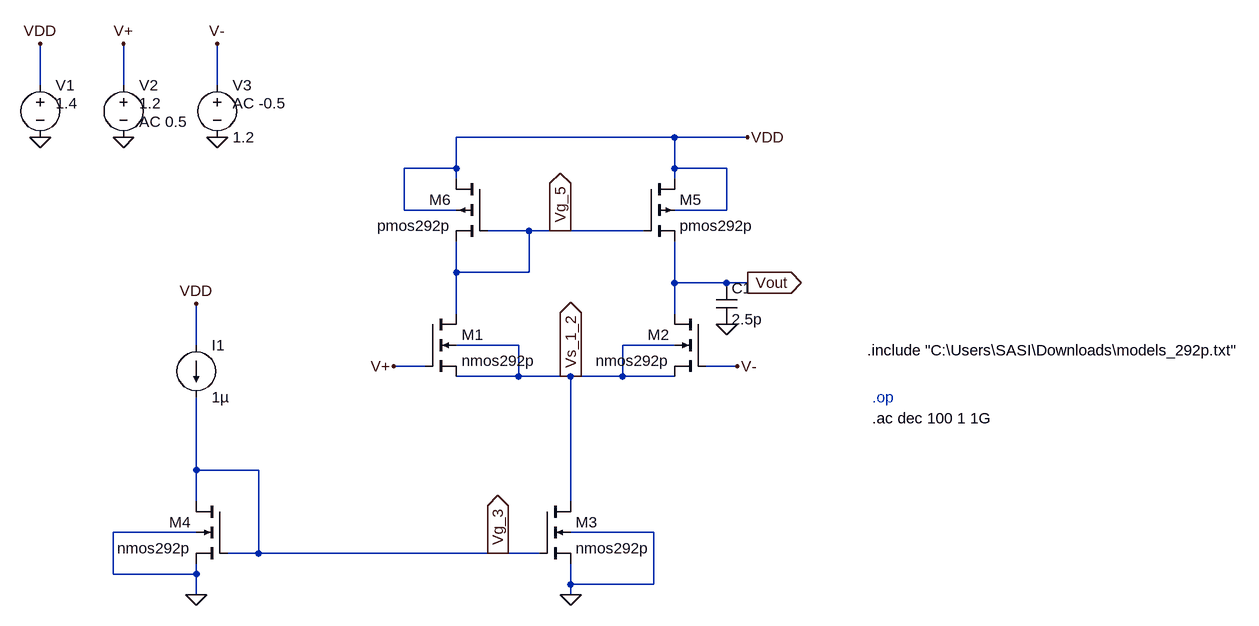
[diagram p0: schematic 5T_OTA_NMOS.asc]
5T_OTA_NMOS.asc, the LTspice schematic file:
Version 4.1
SHEET 1 1052 760
WIRE -864 -64 -864 -128
WIRE -736 -64 -736 -128
WIRE -592 -64 -592 -128
WIRE 112 16 -224 16
WIRE 224 16 112 16
WIRE -224 64 -224 16
WIRE -224 64 -304 64
WIRE 112 64 112 16
WIRE 192 64 112 64
WIRE -224 80 -224 64
WIRE 112 80 112 64
WIRE -304 128 -304 64
WIRE -224 128 -304 128
WIRE 192 128 192 64
WIRE 192 128 112 128
WIRE -112 160 -176 160
WIRE -64 160 -112 160
WIRE 64 160 -64 160
WIRE -224 224 -224 176
WIRE -112 224 -112 160
WIRE -112 224 -224 224
WIRE 112 240 112 176
WIRE 192 240 112 240
WIRE 224 240 192 240
WIRE -224 288 -224 224
WIRE 112 288 112 240
WIRE -624 336 -624 272
WIRE -128 336 -224 336
WIRE 112 336 32 336
WIRE -272 368 -320 368
WIRE 208 368 160 368
WIRE -128 384 -128 336
WIRE -128 384 -224 384
WIRE -48 384 -128 384
WIRE 32 384 32 336
WIRE 32 384 -48 384
WIRE 112 384 32 384
WIRE -624 528 -624 416
WIRE -528 528 -624 528
WIRE -624 576 -624 528
WIRE -48 576 -48 384
WIRE -624 624 -752 624
WIRE 80 624 -48 624
WIRE -528 656 -528 528
WIRE -528 656 -576 656
WIRE -160 656 -528 656
WIRE -96 656 -160 656
WIRE -752 688 -752 624
WIRE -624 688 -624 672
WIRE -624 688 -752 688
WIRE -48 704 -48 672
WIRE 80 704 80 624
WIRE 80 704 -48 704
WIRE -624 720 -624 688
WIRE -48 720 -48 704
FLAG -48 720 0
FLAG -624 720 0
FLAG -864 16 0
FLAG -736 16 0
FLAG -592 16 0
FLAG -736 -128 V+
FLAG -592 -128 V-
FLAG -864 -128 VDD
FLAG -320 368 V+
FLAG 208 368 V-
FLAG 224 16 VDD
FLAG 224 240 Vout
IOPIN 224 240 Out
FLAG -48 384 Vs_1_2
IOPIN -48 384 Out
FLAG -160 656 Vg_3
IOPIN -160 656 Out
FLAG -64 160 Vg_5
IOPIN -64 160 Out
FLAG -624 272 VDD
FLAG 192 304 0
SYMBOL nmos4 -272 288 R0
SYMATTR InstName M1
SYMATTR Value nmos292p
SYMATTR Value2 l=1.260u w=1.92u
SYMBOL nmos4 160 288 M0
SYMATTR InstName M2
SYMATTR Value nmos292p
SYMATTR Value2 l=1.260u w=1.92u
SYMBOL nmos4 -96 576 R0
SYMATTR InstName M3
SYMATTR Value nmos292p
SYMATTR Value2 l=1.260u w=1.92u
SYMBOL nmos4 -576 576 M0
SYMATTR InstName M4
SYMATTR Value nmos292p
SYMATTR Value2 l=1.260u w=1.92u
SYMBOL current -624 336 R0
WINDOW 123 0 0 Left 0
WINDOW 39 0 0 Left 0
SYMATTR InstName I1
SYMATTR Value 1µ
SYMBOL pmos4 64 80 R0
SYMATTR InstName M5
SYMATTR Value pmos292p
SYMATTR Value2 l=1.260u w=8.33u
SYMBOL pmos4 -176 80 M0
SYMATTR InstName M6
SYMATTR Value pmos292p
SYMATTR Value2 l=1.260u w=8.33u
SYMBOL voltage -864 -80 R0
WINDOW 3 24 44 Left 2
WINDOW 123 0 0 Left 0
WINDOW 39 0 0 Left 0
SYMATTR Value 1.4
SYMATTR InstName V1
SYMBOL voltage -736 -80 R0
WINDOW 3 24 44 Left 2
WINDOW 123 24 72 Left 2
WINDOW 39 0 0 Left 0
SYMATTR Value 1.2
SYMATTR Value2 AC 0.5
SYMATTR InstName V2
SYMBOL voltage -592 -80 R0
WINDOW 123 24 44 Left 2
WINDOW 39 0 0 Left 0
SYMATTR Value2 AC -0.5
SYMATTR InstName V3
SYMATTR Value 1.2
SYMBOL cap 176 240 R0
SYMATTR InstName C1
SYMATTR Value 2.5p
TEXT 408 344 Left 2 !.include "C:\\Users\\SASI\\Downloads\\models_292p.txt"
TEXT 416 416 Left 2 ;.op
TEXT 416 448 Left 2 !.ac dec 100 1 1G

The netlist it stands for:
* 5T_OTA_NMOS.asc
M1 Vg_5 V+ Vs_1_2 Vs_1_2 nmos292p l=1.260u w=1.92u
M2 Vout V- Vs_1_2 Vs_1_2 nmos292p l=1.260u w=1.92u
M3 Vs_1_2 Vg_3 0 0 nmos292p l=1.260u w=1.92u
M4 Vg_3 Vg_3 0 0 nmos292p l=1.260u w=1.92u
I1 VDD Vg_3 1µ
M5 VDD Vg_5 Vout VDD pmos292p l=1.260u w=8.33u
M6 VDD Vg_5 Vg_5 VDD pmos292p l=1.260u w=8.33u
V1 VDD 0 1.4
V2 V+ 0 1.2 AC 0.5
V3 V- 0 1.2 AC -0.5
C1 Vout 0 2.5p
.model NMOS NMOS
.model PMOS PMOS
.lib standard.mos
.include "C:\Users\SASI\Downloads\models_292p.txt"
* .op
.ac dec 100 1 1G
.backanno
.end